# Altium schematic sheet [08] PCIe.SchDoc: PCIe x4 edge connector (PCIe x1 only)
size A4; Engineer: M. Folejewski; DocumentNumber: 8; SheetNumber: 8; SheetTotal: 15; PageSize: A4; Designators: 300-399
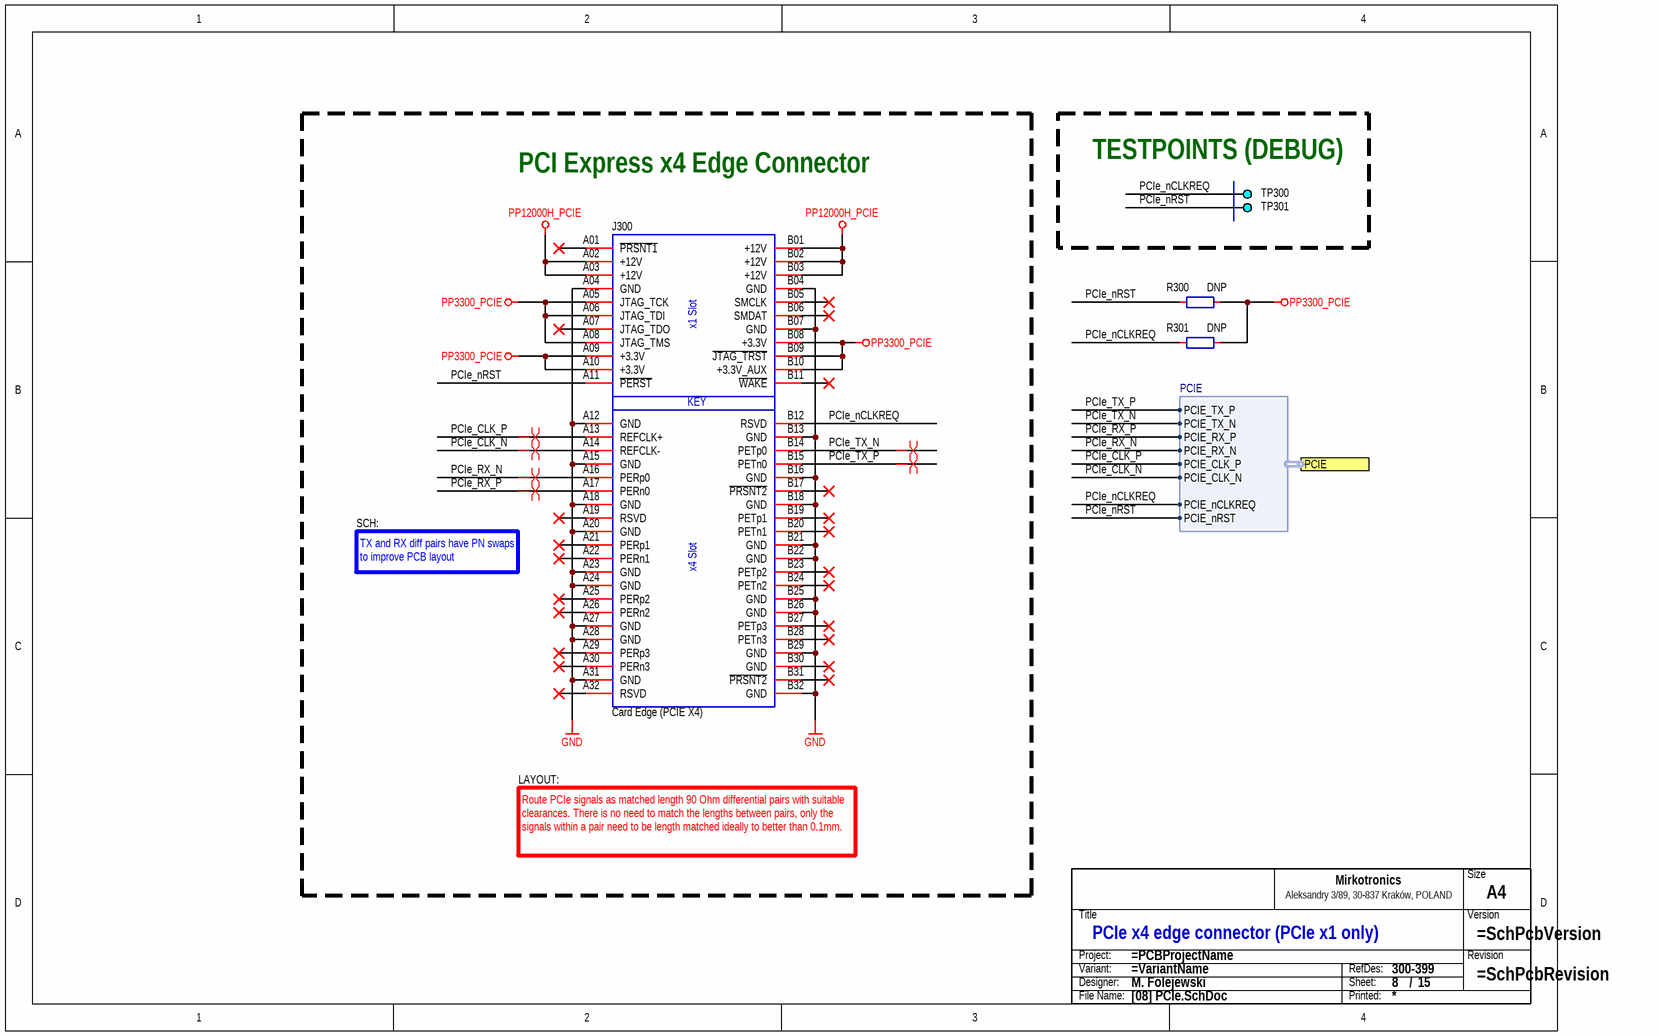
[diagram p0: [08] PCIe.SchDoc]

## Parts
J300  Card Edge (PCIE X4)  [PCB_CARD_EDGE_PCIE_64P]  (no BOM)
R300  DNP  [RES_0603_R]
R301  DNP  [RES_0603_R]
TB?  Title block  (value not drawn)  (graphical)
TP300  DEBUG  [PCB_TP_DBG_50]  (value not drawn)  (no BOM)
TP301  DEBUG  [PCB_TP_DBG_50]  (value not drawn)  (no BOM)

## Ports
PCIE (harness PCIE)

## Harnesses
PCIE: PCIE_TX_P, PCIE_TX_N, PCIE_RX_P, PCIE_RX_N, PCIE_CLK_P, PCIE_CLK_N, PCIE_nCLKREQ, PCIE_nRST

## Nets
GND: J300.A04(GND) J300.A12(GND) J300.A15(GND) J300.A18(GND) J300.A20(GND) J300.A23(GND) J300.A24(GND) J300.A27(GND) J300.A28(GND) J300.A31(GND) J300.B04(GND) J300.B07(GND) J300.B13(GND) J300.B16(GND) J300.B18(GND) J300.B21(GND) J300.B22(GND) J300.B25(GND) J300.B26(GND) J300.B29(GND) J300.B32(GND)
PP3300_PCIE: J300.A05(JTAG_TCK) J300.A06(JTAG_TDI) J300.A08(JTAG_TMS) J300.A09(+3.3V) J300.A10(+3.3V) J300.B08(+3.3V) J300.B09(~{JTAG_T}~{RST}) J300.B10(+3.3V_AUX) R300.1 R301.1
PP12000H_PCIE: J300.A02(+12V) J300.A03(+12V) J300.B01(+12V) J300.B02(+12V) J300.B03(+12V)
PCIe_CLK_N: J300.A14(REFCLK-) ; port PCIE.PCIE_CLK_N
PCIe_CLK_P: J300.A13(REFCLK+) ; port PCIE.PCIE_CLK_P
PCIe_nCLKREQ: J300.B12(RSVD) R301.2 TP300.1 ; port PCIE.PCIE_nCLKREQ
PCIe_nRST: J300.A11(~{PERST}) R300.2 TP301.1 ; port PCIE.PCIE_nRST
PCIe_RX_N: J300.A16(PERp0) ; port PCIE.PCIE_RX_N
PCIe_RX_P: J300.A17(PERn0) ; port PCIE.PCIE_RX_P
PCIe_TX_N: J300.B14(PETp0) ; port PCIE.PCIE_TX_N
PCIe_TX_P: J300.B15(PETn0) ; port PCIE.PCIE_TX_P

Not connected (* = marked no-connect by the designer): J300 A01(~{PRSNT1})* A07(JTAG_TDO)* A19(RSVD)* A21(PERp1)* A22(PERn1)* A25(PERp2)* A26(PERn2)* A29(PERp3)* A30(PERn3)* A32(RSVD)* B05(SMCLK)* B06(SMDAT)* B11(~{WAKE})* B17(~{PRSNT2})* B19(PETp1)* B20(PETn1)* B23(PETp2)* B24(PETn2)* B27(PETp3)* B28(PETn3)* B30(GND)* B31(~{PRSNT2})*

## Layout directives
differential pair: PCIe_CLK_N, PCIe_CLK_P, PCIe_RX_N, PCIe_RX_P, PCIe_TX_N, PCIe_TX_P

## Notes on the sheet
- PCI Express x4 Edge Connector
- TESTPOINTS (DEBUG)
- TX and RX diff pairs have PN swaps to improve PCB layout
- SCH:
- LAYOUT:
- Route PCIe signals as matched length 90 Ohm differential pairs with suitable clearances. There is no need to match the lengths between pairs, only the signals within a pair need to be length matched ideally to better than 0.1mm.
- (in symbol CON_PCIE_64P_VAR2) x1 Slot; KEY; x4 Slot
- (in symbol SCH_TITLE_BLOCK_MIRKOTRONICS_V2) Size; Mirkotronics; Aleksandry 3/89, 30-837 Kraków, POLAND; Title; Version; Project:; Revision; Variant:; RefDes:; Designer:; Sheet:; /; File Name:; Printed:

## Library data of the parts
J300 = CON_PCIE_64P_VAR2: Connector; PCIE, x4 (64pin); Value: Card Edge (PCIE X4); MPN: N/A; Manufacturer: N/A
R300 R301 = RES-0054: Resistor; Thick Film; GENERIC; TBD; TBD; TBD; TBD; TBD; SMD; 0603 (1608);; Component Type: Resistor; Component Subtype: Thick Film; Value: DNP; Manufacturer: GENERIC; MPN: GENERIC; Mounting Type: SMD; Package (Case): 0603 (1608); Supplier: ?
TB? = SCH_TITLE_BLOCK_MIRKOTRONICS_V2: Component Type: Title block; Manufacturer: -; Mounting Type: Non component; MPN: -; Operating Temperature: -; Package: -; Specification: Title block; Value: Title block; Replacement: -; System: ?
TP300 TP301 = PCB_TP_DBG: PCB Marking; Test Point (Debug);; Value: DEBUG; Component Subtype: -; Component Type: Testpoint; Mounting Type: -; Supplier: ?